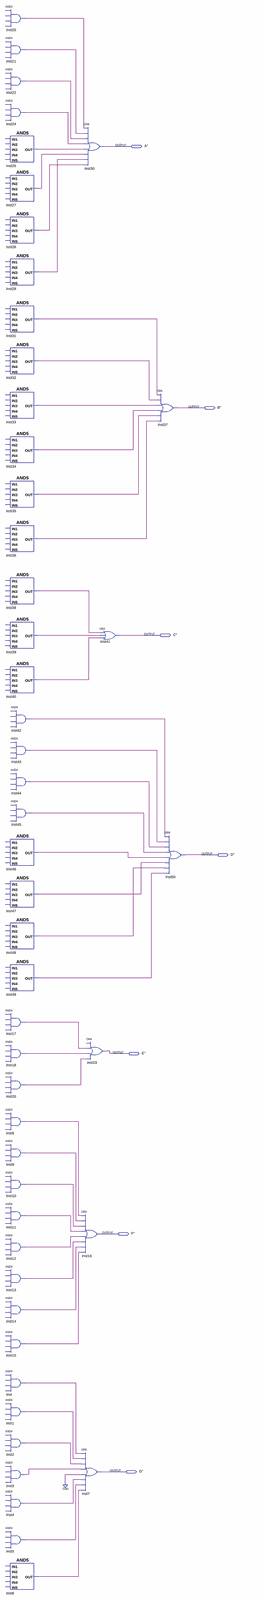
[diagram p0: schematic sheet, whole]
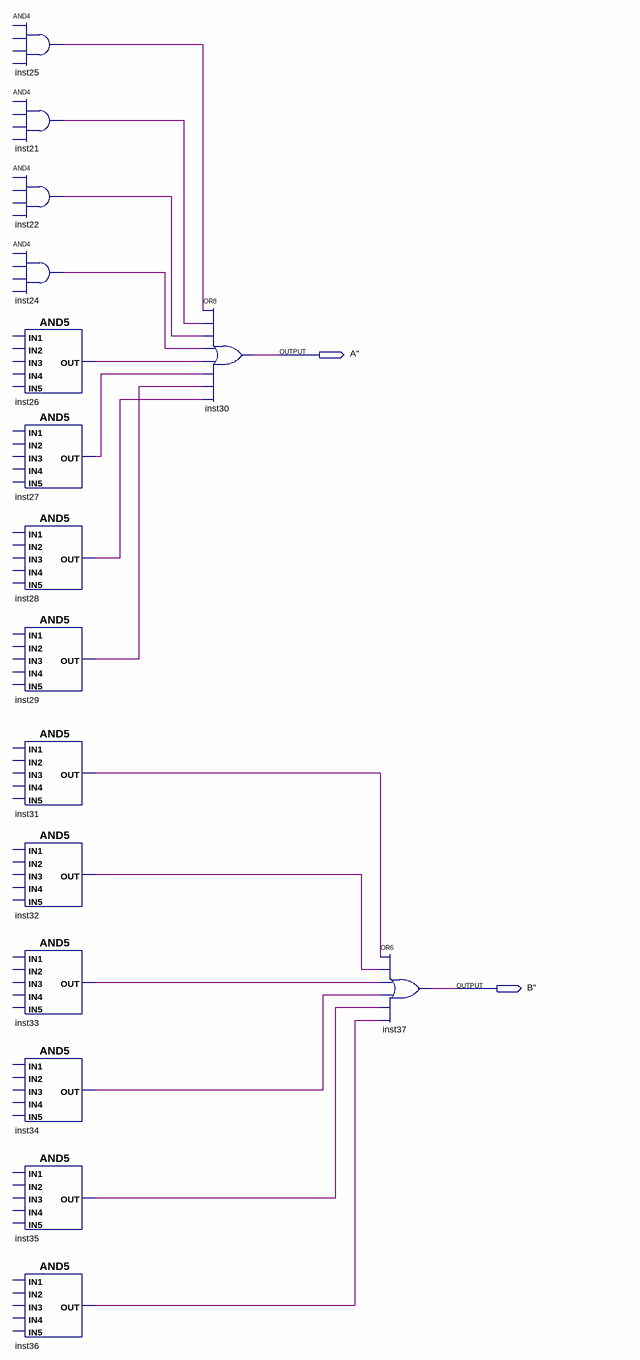
[diagram p1: schematic sheet, upper part]
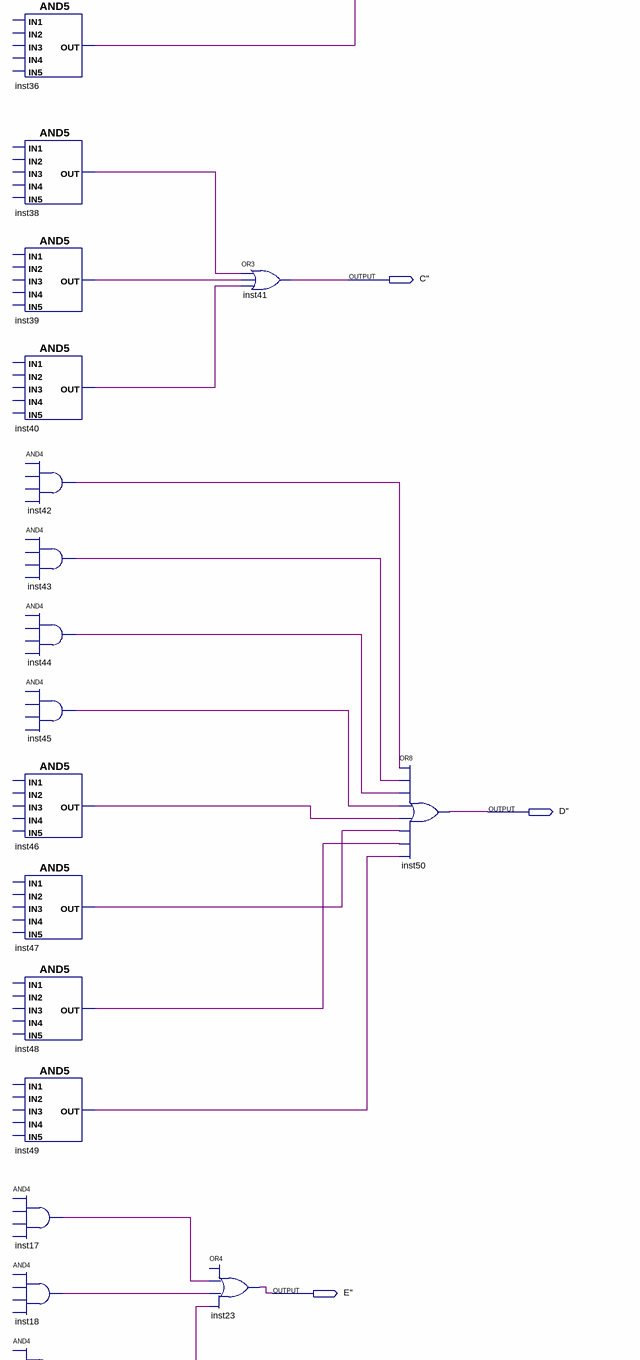
[diagram p2: schematic sheet, middle part]
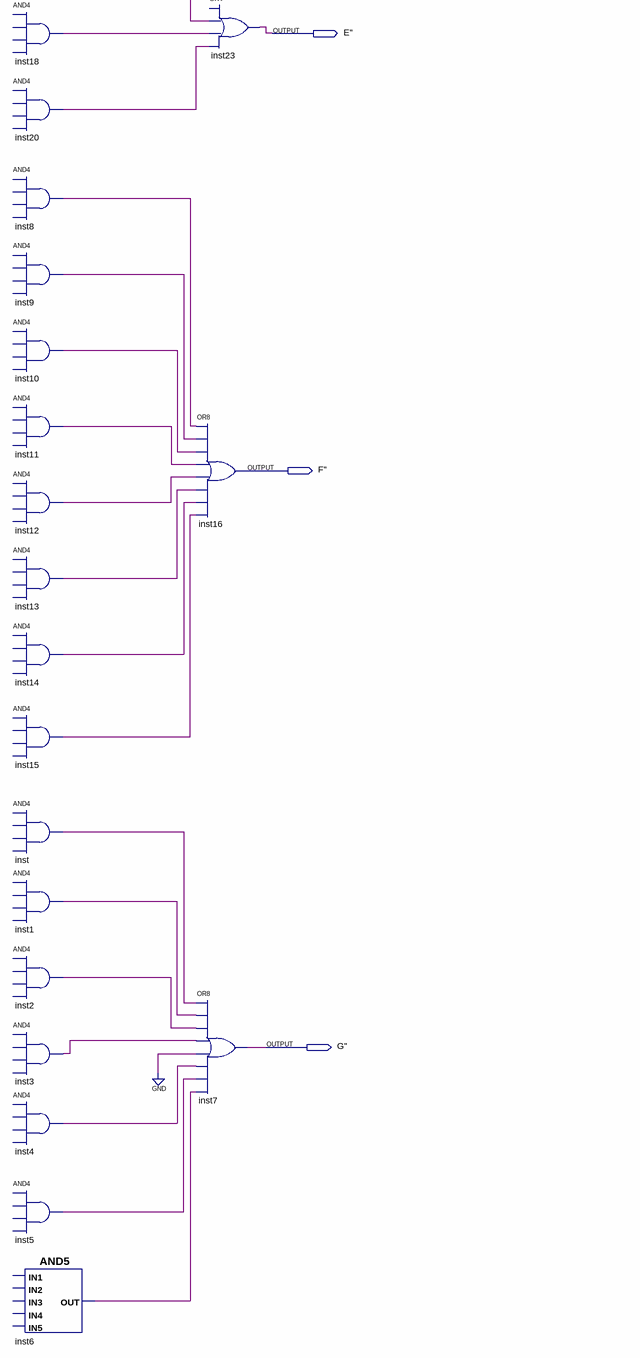
[diagram p3: schematic sheet, lower part]
// Quartus schematic decod.bdf as structural Verilog: 50 symbols, 7 pins
module decod (
  output \A'' ,
  output \B'' ,
  output \C'' ,
  output \D'' ,
  output \E'' ,
  output \F'' ,
  output \G'' 
);

  wire inst1_out, inst2_out, inst3_out, inst4_out, inst5_out, inst6_out, inst8_out, inst9_out, inst10_out,
       inst11_out, inst12_out, inst13_out, inst14_out, inst15_out, inst17_out, inst18_out, inst20_out,
       inst21_out, inst22_out, inst24_out, inst25_out, inst26_out, inst27_out, inst28_out, inst29_out,
       inst31_out, inst32_out, inst33_out, inst34_out, inst35_out, inst36_out, inst38_out, inst39_out,
       inst40_out, inst42_out, inst43_out, inst44_out, inst45_out, inst46_out, inst47_out, inst48_out,
       inst49_out, inst_out;

  // AND4 inst25 has open pins: IN1=open, IN2=open, IN3=open, IN4=open, OUT=inst25_out
  // AND4 inst21 has open pins: IN1=open, IN2=open, IN3=open, IN4=open, OUT=inst21_out
  // AND4 inst22 has open pins: IN1=open, IN2=open, IN3=open, IN4=open, OUT=inst22_out
  // AND4 inst24 has open pins: IN1=open, IN2=open, IN3=open, IN4=open, OUT=inst24_out
  // AND5 inst26 has open pins: IN1=open, IN2=open, IN3=open, IN4=open, IN5=open, OUT=inst26_out
  // AND5 inst27 has open pins: IN1=open, IN2=open, IN3=open, IN4=open, IN5=open, OUT=inst27_out
  // AND5 inst28 has open pins: IN1=open, IN2=open, IN3=open, IN4=open, IN5=open, OUT=inst28_out
  // AND5 inst29 has open pins: IN1=open, IN2=open, IN3=open, IN4=open, IN5=open, OUT=inst29_out
  // AND5 inst31 has open pins: IN1=open, IN2=open, IN3=open, IN4=open, IN5=open, OUT=inst31_out
  // AND5 inst32 has open pins: IN1=open, IN2=open, IN3=open, IN4=open, IN5=open, OUT=inst32_out
  // AND5 inst33 has open pins: IN1=open, IN2=open, IN3=open, IN4=open, IN5=open, OUT=inst33_out
  // AND5 inst34 has open pins: IN1=open, IN2=open, IN3=open, IN4=open, IN5=open, OUT=inst34_out
  // AND5 inst35 has open pins: IN1=open, IN2=open, IN3=open, IN4=open, IN5=open, OUT=inst35_out
  // AND5 inst36 has open pins: IN1=open, IN2=open, IN3=open, IN4=open, IN5=open, OUT=inst36_out
  // AND5 inst38 has open pins: IN1=open, IN2=open, IN3=open, IN4=open, IN5=open, OUT=inst38_out
  // AND5 inst39 has open pins: IN1=open, IN2=open, IN3=open, IN4=open, IN5=open, OUT=inst39_out
  // AND5 inst40 has open pins: IN1=open, IN2=open, IN3=open, IN4=open, IN5=open, OUT=inst40_out
  // AND5 inst46 has open pins: IN1=open, IN2=open, IN3=open, IN4=open, IN5=open, OUT=inst46_out
  // AND5 inst47 has open pins: IN1=open, IN2=open, IN3=open, IN4=open, IN5=open, OUT=inst47_out
  // AND5 inst48 has open pins: IN1=open, IN2=open, IN3=open, IN4=open, IN5=open, OUT=inst48_out
  // AND5 inst49 has open pins: IN1=open, IN2=open, IN3=open, IN4=open, IN5=open, OUT=inst49_out
  // AND4 inst17 has open pins: IN1=open, IN2=open, IN3=open, IN4=open, OUT=inst17_out
  // AND4 inst18 has open pins: IN1=open, IN2=open, IN3=open, IN4=open, OUT=inst18_out
  // AND4 inst20 has open pins: IN1=open, IN2=open, IN3=open, IN4=open, OUT=inst20_out
  // AND4 inst8 has open pins: IN1=open, IN2=open, IN3=open, IN4=open, OUT=inst8_out
  // AND4 inst9 has open pins: IN1=open, IN2=open, IN3=open, IN4=open, OUT=inst9_out
  // AND4 inst10 has open pins: IN1=open, IN2=open, IN3=open, IN4=open, OUT=inst10_out
  // AND4 inst11 has open pins: IN1=open, IN2=open, IN3=open, IN4=open, OUT=inst11_out
  // AND4 inst12 has open pins: IN1=open, IN2=open, IN3=open, IN4=open, OUT=inst12_out
  // AND4 inst13 has open pins: IN1=open, IN2=open, IN3=open, IN4=open, OUT=inst13_out
  // AND4 inst14 has open pins: IN1=open, IN2=open, IN3=open, IN4=open, OUT=inst14_out
  // AND4 inst15 has open pins: IN1=open, IN2=open, IN3=open, IN4=open, OUT=inst15_out
  // AND4 inst has open pins: IN1=open, IN2=open, IN3=open, IN4=open, OUT=inst_out
  // AND4 inst1 has open pins: IN1=open, IN2=open, IN3=open, IN4=open, OUT=inst1_out
  // AND4 inst2 has open pins: IN1=open, IN2=open, IN3=open, IN4=open, OUT=inst2_out
  // AND4 inst3 has open pins: IN1=open, IN2=open, IN3=open, IN4=open, OUT=inst3_out
  // AND4 inst4 has open pins: IN1=open, IN2=open, IN3=open, IN4=open, OUT=inst4_out
  // AND4 inst5 has open pins: IN1=open, IN2=open, IN3=open, IN4=open, OUT=inst5_out
  // AND5 inst6 has open pins: IN1=open, IN2=open, IN3=open, IN4=open, IN5=open, OUT=inst6_out
  // AND4 inst42 has open pins: IN1=open, IN2=open, IN3=open, IN4=open, OUT=inst42_out
  // AND4 inst43 has open pins: IN1=open, IN2=open, IN3=open, IN4=open, OUT=inst43_out
  // AND4 inst44 has open pins: IN1=open, IN2=open, IN3=open, IN4=open, OUT=inst44_out
  // AND4 inst45 has open pins: IN1=open, IN2=open, IN3=open, IN4=open, OUT=inst45_out
  or inst30 (\A'' , inst25_out, inst21_out, inst22_out, inst24_out, inst26_out, inst27_out, inst29_out, inst28_out);
  or inst23 (\E'' , inst17_out, inst18_out, inst20_out);  // open: IN1
  or inst16 (\F'' , inst8_out, inst9_out, inst10_out, inst11_out, inst12_out, inst13_out, inst14_out, inst15_out);
  or inst7 (\G'' , inst_out, inst1_out, inst2_out, inst3_out, 1'b0, inst4_out, inst5_out, inst6_out);
  or inst41 (\C'' , inst38_out, inst39_out, inst40_out);
  or inst37 (\B'' , inst31_out, inst32_out, inst33_out, inst34_out, inst35_out, inst36_out);
  or inst50 (\D'' , inst42_out, inst43_out, inst44_out, inst45_out, inst46_out, inst47_out, inst48_out, inst49_out);
endmodule
